# EAGLE design tinyha_meas (EAGLE 7.5.0)
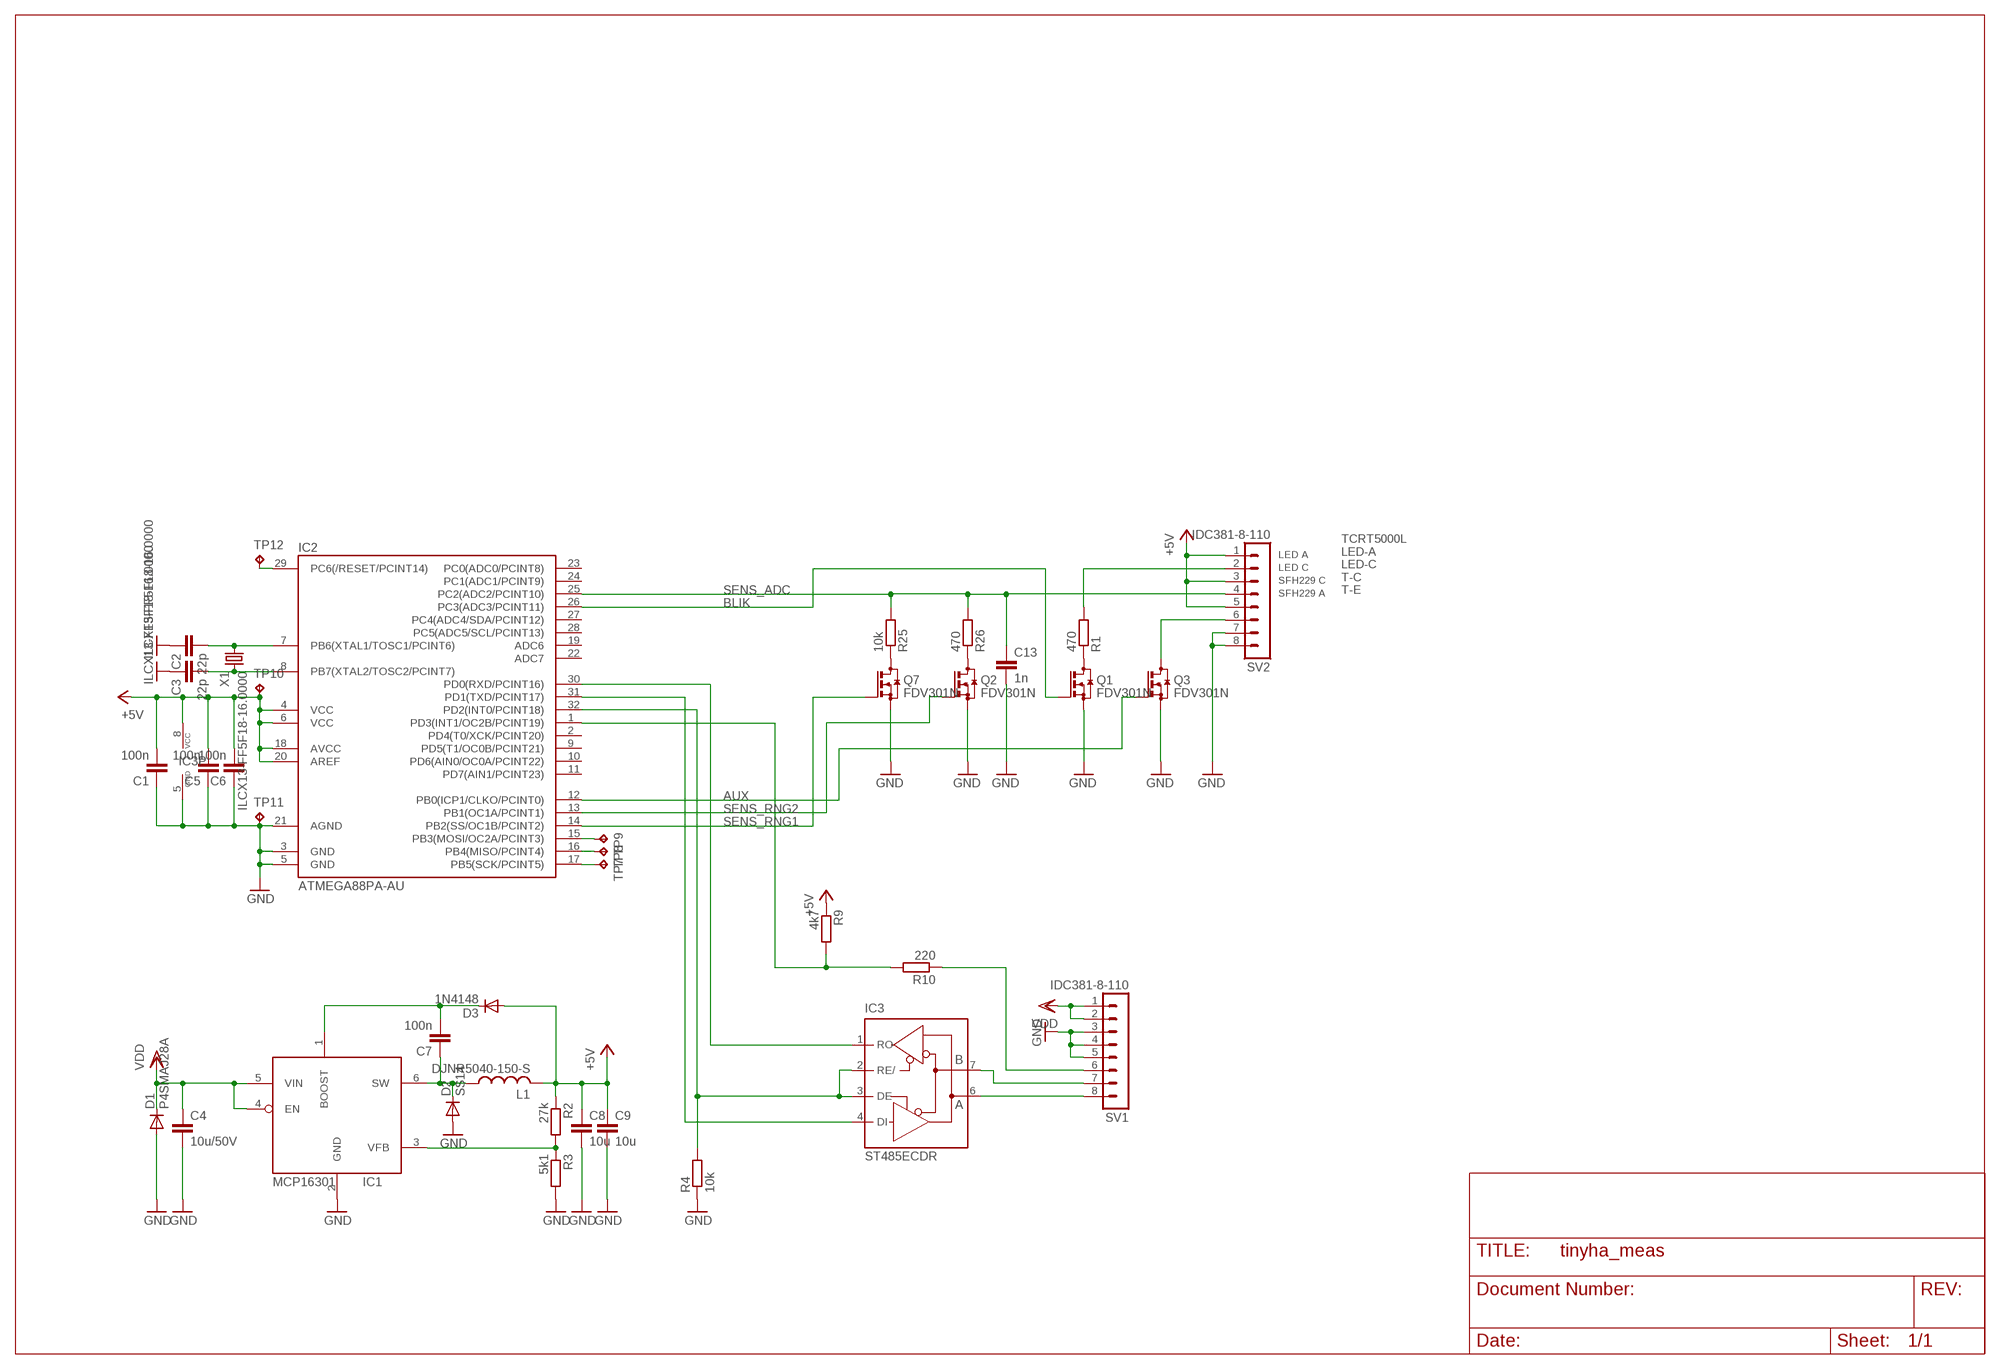
[diagram p0: schematic, sheet 1]

## Parts
C1  100n  C-EUC0603K  [C0603K]
C2  22p  C-EUC0603K  [C0603K]
C3  22p  C-EUC0603K  [C0603K]
C4  10u/50V  C-EUC1210K  [C1210K]
C5  100n  C-EUC0603K  [C0603K]
C6  100n  C-EUC0603K  [C0603K]
C7  100n  C-EUC0603K  [C0603K]
C8  10u  C-EUC0805K  [C0805K]
C9  10u  C-EUC0805K  [C0805K]
C13  1n  C-EUC0603  [C0603]
D1  P4SMAJ28A  DIODE-DO214AC  [DO214AC]
D2  SS14  DIODE-DO214AC  [DO214AC]
D3  1N4148  DIODE-MICROMELF-W  [MICROMELF-W]
IC1  MCP16301  [SOT23-6L]
IC2  ATMEGA88PA-AU  ATMEGA48/88/168-MU  [MLF32]
IC3  ST485ECDR  MAX481CSA  [SO08]
L1  DJNR5040-150-S  DJNR5040  [DJNR5040]
Q1  FDV301N  BSS123  [SOT23]
Q2  FDV301N  BSS123  [SOT23]
Q3  FDV301N  BSS123  [SOT23]
Q7  FDV301N  BSS123  [SOT23]
R1  470  R-EU_R0603  [R0603]
R2  27k  R-EU_R0603  [R0603]
R3  5k1  R-EU_R0603  [R0603]
R4  10k  R-EU_R0603  [R0603]
R9  4k7  R-EU_R0603  [R0603]
R10  220  R-EU_R0603  [R0603]
R25  10k  R-EU_R0603  [R0603]
R26  470  R-EU_R0603  [R0603]
SV1  IDC381-8-110  MA08-1-IDC  [IDC381-8]
SV2  IDC381-8-110  MA08-1-IDC  [IDC381-8]
TP7  TPB1,27  [B1,27]
TP8  TPB1,27  [B1,27]
TP9  TPB1,27  [B1,27]
TP10  TPB1,27  [B1,27]
TP11  TPB1,27  [B1,27]
TP12  TPB1,27  [B1,27]
X1  ILCX13-FF5F18-16.0000  XTAL-3225  [SMD3225]

## Nets
+5V: C1.2 C5.2 C6.2 C8.1 C9.1 D3.A IC2.4(VCC) IC2.6(VCC) IC2.18(AVCC) IC2.20(AREF) IC3.8(VCC) L1.2 R2.1 R9.1 SV2.1 SV2.3 SV2.5 TP10.TP
AUX: IC2.12(PB0(ICP1/CLKO/PCINT0)) Q3.1(G)
BLIK: IC2.26(PC3(ADC3/PCINT11)) Q1.1(G)
DIR: IC2.32(PD2(INT0/PCINT18)) IC3.2(RE/) IC3.3(DE) R4.2
GND: C1.1 C2.1 C3.1 C4.2 C5.1 C6.1 C8.2 C9.2 C13.2 D1.A D2.A IC1.2(GND) IC2.3(GND) IC2.5(GND) IC2.21(AGND) IC3.5(GND) Q1.2(S) Q2.2(S) Q3.2(S) Q7.2(S) R3.2 R4.1 SV1.3 SV1.4 SV1.5 SV2.7 SV2.8 TP11.TP X1.2(GND) X1.4(GND)
N$1: Q7.3(D) R25.1
N$2: Q2.3(D) R26.1
N$3: R1.2 SV2.2
N$4: Q3.3(D) SV2.6
N$7: Q1.3(D) R1.1
N$8: IC2.29(PC6(/RESET/PCINT14)) TP12.TP
N$10: IC3.7(B) SV1.7
N$14: IC1.3(VFB) R2.2 R3.1
N$15: IC2.15(PB3(MOSI/OC2A/PCINT3)) TP9.TP
N$18: R10.1 SV1.6
N$19: IC2.1(PD3(INT1/OC2B/PCINT19)) R9.2 R10.2
N$20: C7.1 D2.C IC1.6(SW) L1.1
N$22: C7.2 D3.C IC1.1(BOOST)
N$23: IC3.6(A) SV1.8
N$24: C3.2 IC2.8(PB7(XTAL2/TOSC2/PCINT7)) X1.3
N$31: C2.2 IC2.7(PB6(XTAL1/TOSC1/PCINT6)) X1.1
RXD: IC2.30(PD0(RXD/PCINT16)) IC3.1(RO)
SENS_ADC: C13.1 IC2.25(PC2(ADC2/PCINT10)) R25.2 R26.2 SV2.4
SENS_RNG1: IC2.14(PB2(SS/OC1B/PCINT2)) Q7.1(G)
SENS_RNG2: IC2.13(PB1(OC1A/PCINT1)) Q2.1(G)
TXD: IC2.31(PD1(TXD/PCINT17)) IC3.4(DI)
UH: IC2.16(PB4(MISO/PCINT4)) TP8.TP
VDD: C4.1 D1.C IC1.4(EN) IC1.5(VIN) SV1.1 SV1.2
WH: IC2.17(PB5(SCK/PCINT5)) TP7.TP
Unconnected: IC2.2(PD4(T0/XCK/PCINT20)) IC2.9(PD5(T1/OC0B/PCINT21)) IC2.10(PD6(AIN0/OC0A/PCINT22)) IC2.11(PD7(AIN1/PCINT23)) IC2.19(ADC6) IC2.22(ADC7) IC2.23(PC0(ADC0/PCINT8)) IC2.24(PC1(ADC1/PCINT9)) IC2.27(PC4(ADC4/SDA/PCINT12)) IC2.28(PC5(ADC5/SCL/PCINT13))

## Notes on the sheet
- LED A
- LED C
- SFH229 C
- TCRT5000L
  LED-A
  LED-C
  T-C
  T-E
- SFH229 A

## Library data of the parts
C1-C9 C13 = rcl:C-EU: CAPACITOR, European symbol
D1-D3 = diode:DIODE-: DIODE
IC1 = custom:MCP16301
IC2 = atmega8:ATMEGA48/88/168
IC3 = maxim:MAX481CSA: RS485 TRANSEIVER; MF: MAXIM; MPN: MAX481CSA; OC_FARNELL: unknown; OC_NEWARK: 90C3817
L1 = custom:DJNR5040
Q1-Q3 Q7 = transistor-small-signal:BSS123: N-CHANNEL MOS FET
R1-R4 R9 R10 R25 R26 = rcl:R-EU_: RESISTOR, European symbol
SV1 SV2 = custom:MA08-1: PIN HEADER
TP7-TP12 = testpad:TP: Test pad
X1 = custom:XTAL-3225

## Board
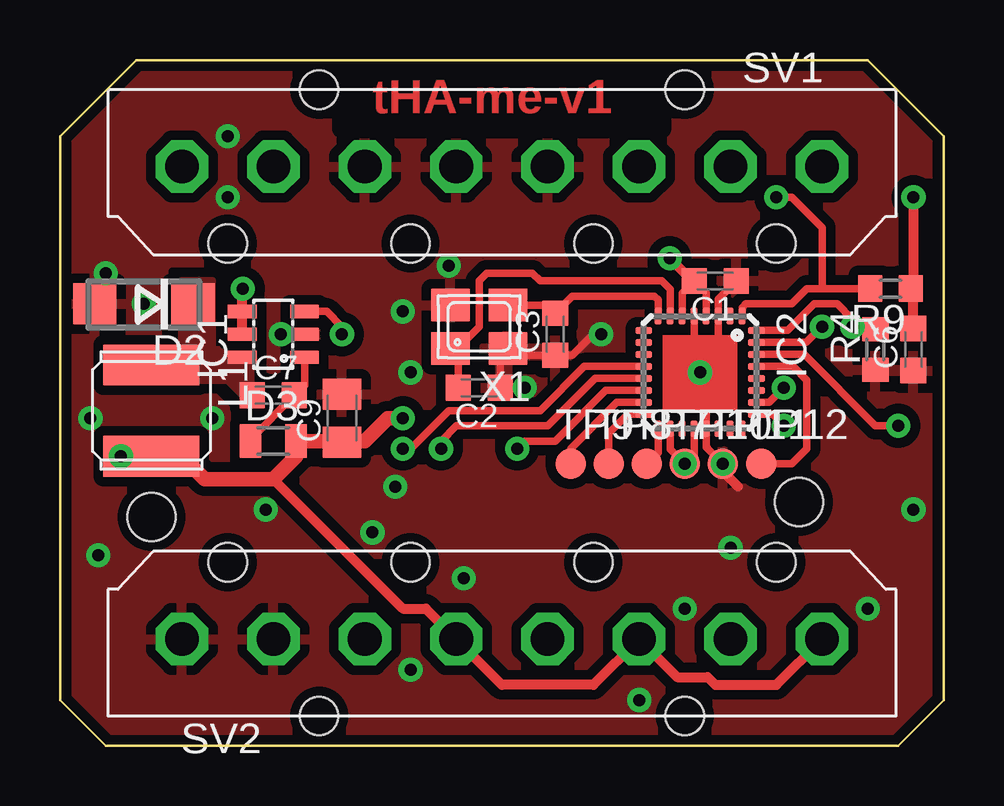
[diagram p1: board, top side]
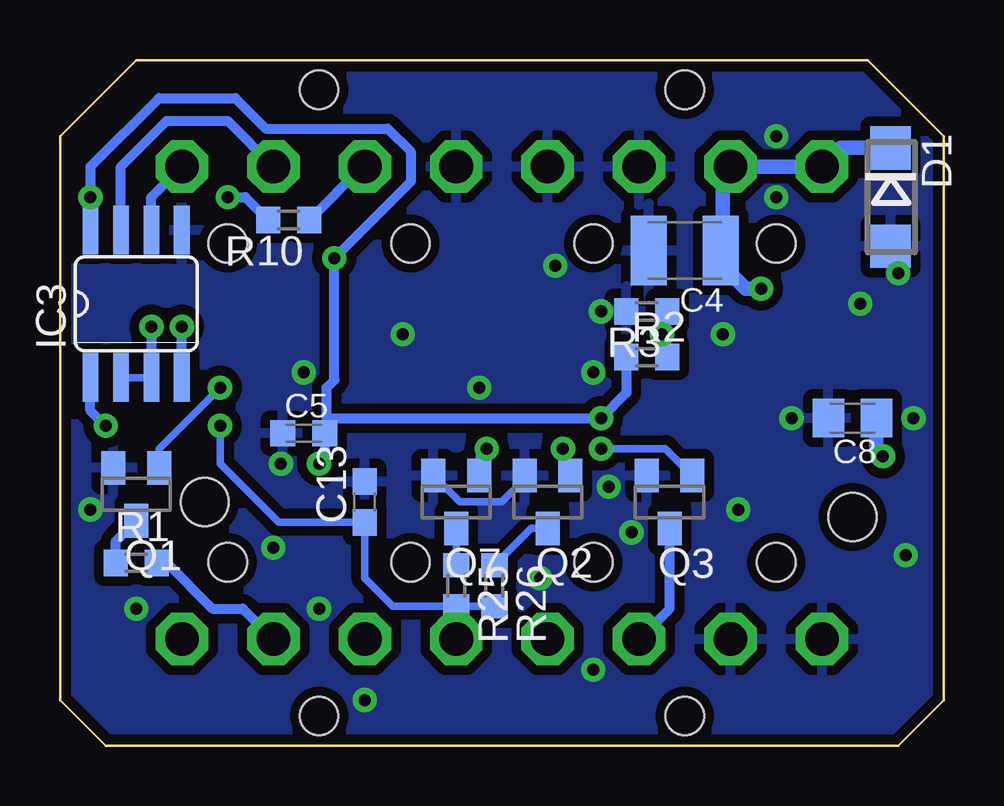
[diagram p2: board, bottom side, seen from below]

Size 36.83 x 28.57 mm. Coordinates in mm from the lower left corner, seen from the top.
Outline: 33.66,28.57 3.17,28.57 0,25.4 0,1.91 1.91,0 34.92,0 36.83,1.91 36.83,25.4 33.66,28.57
Copper layers (1*16): Top 0.035mm / dielectric 1.5mm / Bottom 0.035mm
Design rules "temp *": minimum track width 10mil, minimum drill 0.5mm, track to track 0.19mm, track to pad 0.19mm, pad to pad 0.19mm, via to via 0.2mm, smd to smd 0mil, copper to edge 16mil, drill to drill 8mil, minimum pad ring 14mil, minimum via ring 10mil, stop-mask expansion 4mil, vias tented up to drill 0.6mm, thermal gap 16mil
Holes 2 mm at 30.8,10.16 3.81,9.53
tRestrict: 3 lines

### Footprints (pad centres in the part's own frame; a part is rotated, then mirrored left to right if it is on the bottom)
C0603K = smd 1.05 x 1.08: 1 -0.875,0; 2 0.875,0
C1210K = smd 1.5 x 2.9: 1 -1.5,0; 2 1.5,0
C0805K = smd 1.3 x 1.6: 1 -1,0; 2 1,0
C0603 = smd 1.1 x 1: 1 -0.85,0; 2 0.85,0
DO214AC = smd 1.8 x 1.7: A 2.05,0; C -2.05,0
MICROMELF-W = smd 0.9 x 1.4: A 0.95,0; C -0.95,0
SOT23-6L = smd 0.55 x 1.2: 1 -0.95,-1.3; 2 0,-1.3; 3 0.95,-1.3; 4 0.95,1.3; 5 0,1.3; 6 -0.95,1.3
MLF32 = smd 0.7 x 0.3: 1 -2.35,1.75; 2 -2.35,1.25; 3 -2.35,0.75; 4 -2.35,0.25; 5 -2.35,-0.25; 6 -2.35,-0.75; 7 -2.35,-1.25; 8 -2.35,-1.75; 17 2.35,-1.75; 18 2.35,-1.25; 19 2.35,-0.75; 20 2.35,-0.25; 21 2.35,0.25; 22 2.35,0.75; 23 2.35,1.25; 24 2.35,1.75 | smd 0.3 x 0.7: 9 -1.75,-2.35; 10 -1.25,-2.35; 11 -0.75,-2.35; 12 -0.25,-2.35; 13 0.25,-2.35; 14 0.75,-2.35; 15 1.25,-2.35; 16 1.75,-2.35; 25 1.75,2.35; 26 1.25,2.35; 27 0.75,2.35; 28 0.25,2.35; 29 -0.25,2.35; 30 -0.75,2.35; 31 -1.25,2.35; 32 -1.75,2.35
SO08 = smd 0.66 x 2.032: 1 -1.905,-3.073; 2 -0.635,-3.073; 3 0.635,-3.073; 4 1.905,-3.073; 5 1.905,3.073; 6 0.635,3.073; 7 -0.635,3.073; 8 -1.905,3.073
DJNR5040 = smd 1.7 x 4: 1 -1.9,0; 2 1.9,0
SOT23 = smd 1 x 1.4: 1 -0.95,-1.1; 2 0.95,-1.1; 3 0,1.1
R0603 = smd 1 x 1.1: 1 -0.85,0; 2 0.85,0
IDC381-8 = drill 1.4 pad 2.184 octagon: 1 -13.335,0; 2 -9.525,0; 3 -5.715,0; 4 -1.905,0; 5 1.905,0; 6 5.715,0; 7 9.525,0; 8 13.335,0 | hole 1.6: -11.43,-3.2; -3.81,-3.2; 3.81,-3.2; 11.43,-3.2; -7.62,3.2; 7.62,3.2
B1,27 = smd 1.27 x 1.27: TP 0,0
SMD3225 = smd 1.6 x 1.35: 1 1.2,0.9; 2 -1.2,0.9; 3 -1.2,-0.9; 4 1.2,-0.9

### Placement (x,y rotation side)
C1  27.3,19.37 180 top
C2  17.46,14.92 180 top
C3  20.64,17.14 90 top
C4  10.79,20.64 180 bottom
C5  26.67,13.02 0 bottom
C6  35.56,16.51 90 top
C7  8.89,14.61 0 top
C8  3.81,13.65 180 bottom
C9  11.75,13.65 90 top
C13  24.13,10.16 90 bottom
D1  2.22,22.86 270 bottom
D2  3.49,18.41 180 top
D3  8.89,12.7 0 top
IC1  8.89,17.14 90 top
IC2  26.67,15.56 270 top
IC3  33.66,18.41 0 bottom
L1  3.81,13.97 270 top
Q1  33.66,10.48 180 bottom
Q2  16.51,10.16 180 bottom
Q3  11.43,10.16 180 bottom
Q7  20.32,10.16 180 bottom
R1  33.66,7.62 0 bottom
R2  12.38,16.19 0 bottom
R3  12.38,18.1 180 bottom
R4  33.97,16.51 90 top
R9  34.61,19.05 180 top
R10  27.3,21.91 180 bottom
R25  20.32,6.67 270 bottom
R26  18.73,6.67 270 bottom
SV1  18.41,24.13 0 top
SV2  18.41,4.45 180 top
TP7  24.45,11.75 0 top
TP8  22.86,11.75 0 top
TP9  21.27,11.75 0 top
TP10  26.04,11.75 0 top
TP11  27.62,11.75 0 top
TP12  29.21,11.75 0 top
X1  17.46,17.46 180 top

### Tracks (layer width: path | path; a pad name or v marks a point on that pad's centre or on a via)
+5V  (via drill 0.5)
  Top 0.305: IC2.18 25.42,12.36 TP10.TP 26.42,12.13 IC2.20 | IC2.4 26.92,18.88 C1.2 25.92,18.86 IC2.6
  Top 0.406: 4.19,11.69 L1.2 | C1.2 26.35,19.37 v25.4,20.32 | C9.1 11.48,12.65 11.43,12.7 | v35.56,22.86 35.56,19.15 R9.1 35.56,18.95 C6.2 | SV2.1 29.84,2.54 27.3,2.54 26.99,2.86 25.72,2.86 SV2.3 22.23,2.54 18.41,2.54 SV2.5 15.24,5.71 14.29,5.71 8.89,11.11
  Top 0.61: L1.2 5.08,12.06 6.03,11.11 8.89,11.11 9.84,12.06 D3.A 11.43,12.7 | v2.54,12.06 L1.2 | v14.29,13.65 13.65,13.65 12.7,12.7 11.79,12.7 C9.1
  Top 0.813: L1.2
  Bottom 0.406: TP10.TP 25.8,11.99 C5.2 25.72,13.1 25.72,13.65 | 25.72,13.65 25.72,14.92 25.4,15.24 v25.4,20.32 22.23,23.5 22.23,24.77 23.18,25.72 28.26,25.72 29.53,26.99 32.7,26.99 35.56,24.13 v35.56,22.86 IC3.8 | R2.1 13.23,14.71 v14.29,13.65 25.72,13.65
  Bottom 0.61: C8.1 2.81,12.34 v2.54,12.06
  other vias: 26.04,11.75
AUX  (via drill 0.5)
  Top 0.305: IC2.12 21.84,15.81 20,13.97 16.19,13.97 14.61,12.38 v14.29,12.38
  Bottom 0.305: v14.29,12.38 11.6,12.38 Q3.1
BLIK  (via drill 0.5)
  Top 0.305: IC2.26 29.55,14.31 v30.16,14.92
  Bottom 0.305: v30.16,14.92 32.7,12.38 Q1.1
DIR  (via drill 0.5)
  Top 0.305: v33.02,17.46 33.02,17.78 32.38,18.41 31.43,18.41 30.32,17.31 IC2.32
  Top 0.406: v33.02,17.46 33.87,17.46 R4.2
  Bottom 0.305: IC3.3 IC3.2
  Bottom 0.406: v33.02,17.46 IC3.3
GND  (via drill 0.5)
  Top 0.305: C1.1 27.42,18.61 IC2.3 27.42,16.31 v26.67,15.56 | IC2.5 26.42,15.81 v26.67,15.56 | v26.67,15.56 26.92,15.31 IC2.21 26.92,12.45 TP11.TP | C2.1 18.34,16.24 X1.2 18.95,16.27 C3.1 21.35,16.27 22.23,17.14 v22.54,17.14
  Top 0.406: TP11.TP 27.62,11.43 28.26,10.79
  Bottom 0.305: Q2.2 17.46,11.12 18.41,10.16 20.17,10.16 Q7.2
  other vias: 9.21,17.14 27.62,11.75 16.19,20 14.61,15.56 14.29,18.1 6.35,13.65 1.27,13.65 1.91,19.68 6.99,25.4 6.99,22.86 3.49,18.41 35.56,9.84 19.37,14.92 1.59,7.94 8.57,9.84 13.97,10.79 13.02,8.89 16.83,6.99 14.61,3.17 26.04,5.71 33.66,5.71 24.13,1.91 27.94,8.26
  pour Top (isolate 0.406, rank 2): 0,28.57 36.83,28.57 36.83,0 0,0
  pour Bottom (isolate 0.406): 0,28.57 36.83,28.57 36.83,0 0,0
N$1
  Bottom 0.305: Q7.3 R25.1
N$2
  Bottom 0.305: Q2.3 17.19,9.06 R26.1
N$3
  Bottom 0.406: R1.2 32.38,7.62 30.48,5.71 29.21,5.71 SV2.2
N$4
  Bottom 0.406: SV2.6 11.43,5.71 Q3.3
N$7
  Bottom 0.406: R1.1 34.51,8.53 Q1.3
N$8
  Top 0.305: 29.59,15.81 IC2.29 30.55,15.81 31.11,15.24 31.11,12.38 30.48,11.75 TP12.TP
N$10
  Bottom 0.406: IC3.7 34.29,24.13 32.38,26.04 29.84,26.04 SV1.7
N$14  (via drill 0.5)
  Top 0.305: v11.75,17.14 11.75,17.46 11.11,18.1 IC1.3
  Bottom 0.305: R2.2 11.75,16.41 v11.75,17.14 11.75,17.88 R3.1
N$15
  Top 0.305: IC2.15 23.2,14.31 21.27,12.38 TP9.TP
N$18
  Bottom 0.406: SV1.6 24.23,24.13 R10.1
N$19  (via drill 0.5)
  Top 0.305: IC2.1 28.42,18.26 28.57,18.41 30.48,18.41 31.11,19.05 31.75,19.05 | R9.2 31.75,19.05 | 31.75,19.05 31.75,21.59 30.48,22.86 v29.84,22.86
  Bottom 0.406: v29.84,22.86 29.11,22.86 R10.2
N$20
  pour Top (isolate 0.406, no thermals): 5.08,19.37 5.08,15.24 6.99,15.24 7.62,14.61 7.94,14.61 7.94,16.51 6.35,16.51 6.35,19.37
N$22
  Top 0.305: IC1.1 10.19,15.03 C7.2 7.94,12.78 D3.C
N$23
  Bottom 0.406: IC3.6 33.02,22.86 SV1.8
N$24
  Top 0.305: IC2.8 24.92,18.58 24.77,18.73 21.35,18.73 C3.2 20.3,18.36 X1.3
N$31
  Top 0.305: IC2.7 25.42,19.03 25.08,19.37 20,19.37 19.68,19.68 17.78,19.68 17.46,19.37 17.46,17.46 16.56,16.56 X1.1 16.59,16.24 C2.2
RXD  (via drill 0.5)
  Top 0.305: v34.92,13.34 33.97,13.34 31,16.31 IC2.30
  Bottom 0.406: v34.92,13.34 35.56,13.97 IC3.1
SENS_ADC  (via drill 0.5)
  Top 0.305: IC2.25 29.69,13.81 v30.16,13.34
  Bottom 0.305: R26.2 R25.2 | R25.2 SV2.4 | R25.2 22.96,5.82 24.13,6.99 C13.1 27.73,9.31 30.16,11.75 v30.16,13.34
SENS_RNG1  (via drill 0.5)
  Top 0.305: IC2.14 22.75,14.81 20.64,12.7 19.37,12.7 v19.05,12.38
  Bottom 0.305: v19.05,12.38 19.37,12.06 Q7.1
SENS_RNG2  (via drill 0.5)
  Top 0.305: IC2.13 22.29,15.31 20.32,13.34 16.51,13.34 15.88,12.7 v15.88,12.38
  Bottom 0.305: v15.88,12.38 15.88,11.57 Q2.1
TXD  (via drill 0.5)
  Top 0.305: IC2.31 31.09,16.81 v31.75,17.46
  Bottom 0.406: IC3.4 v31.75,17.46
UH
  Top 0.305: IC2.16 23.65,13.81 22.86,13.02 TP8.TP
VDD  (via drill 0.5)
  Top 0.406: IC1.5 IC1.4 7.59,19.02 v7.62,19.05
  Bottom 0.61: 9.21,20.73 9.21,23.18 8.89,23.5 SV1.2 SV1.1 4.3,24.91 D1.C | v7.62,19.05 8.26,19.05 9.53,20.32 9.53,20.41 C4.1
  Bottom 0.813: 9.21,20.73 C4.1 9.21,20.55
WH
  Top 0.305: IC2.17 24.92,12.22 TP7.TP

### Text on the board
Top: tHA-me-v1